# EAGLE design tiny (EAGLE 6.1)

## Sheet 1 of 2
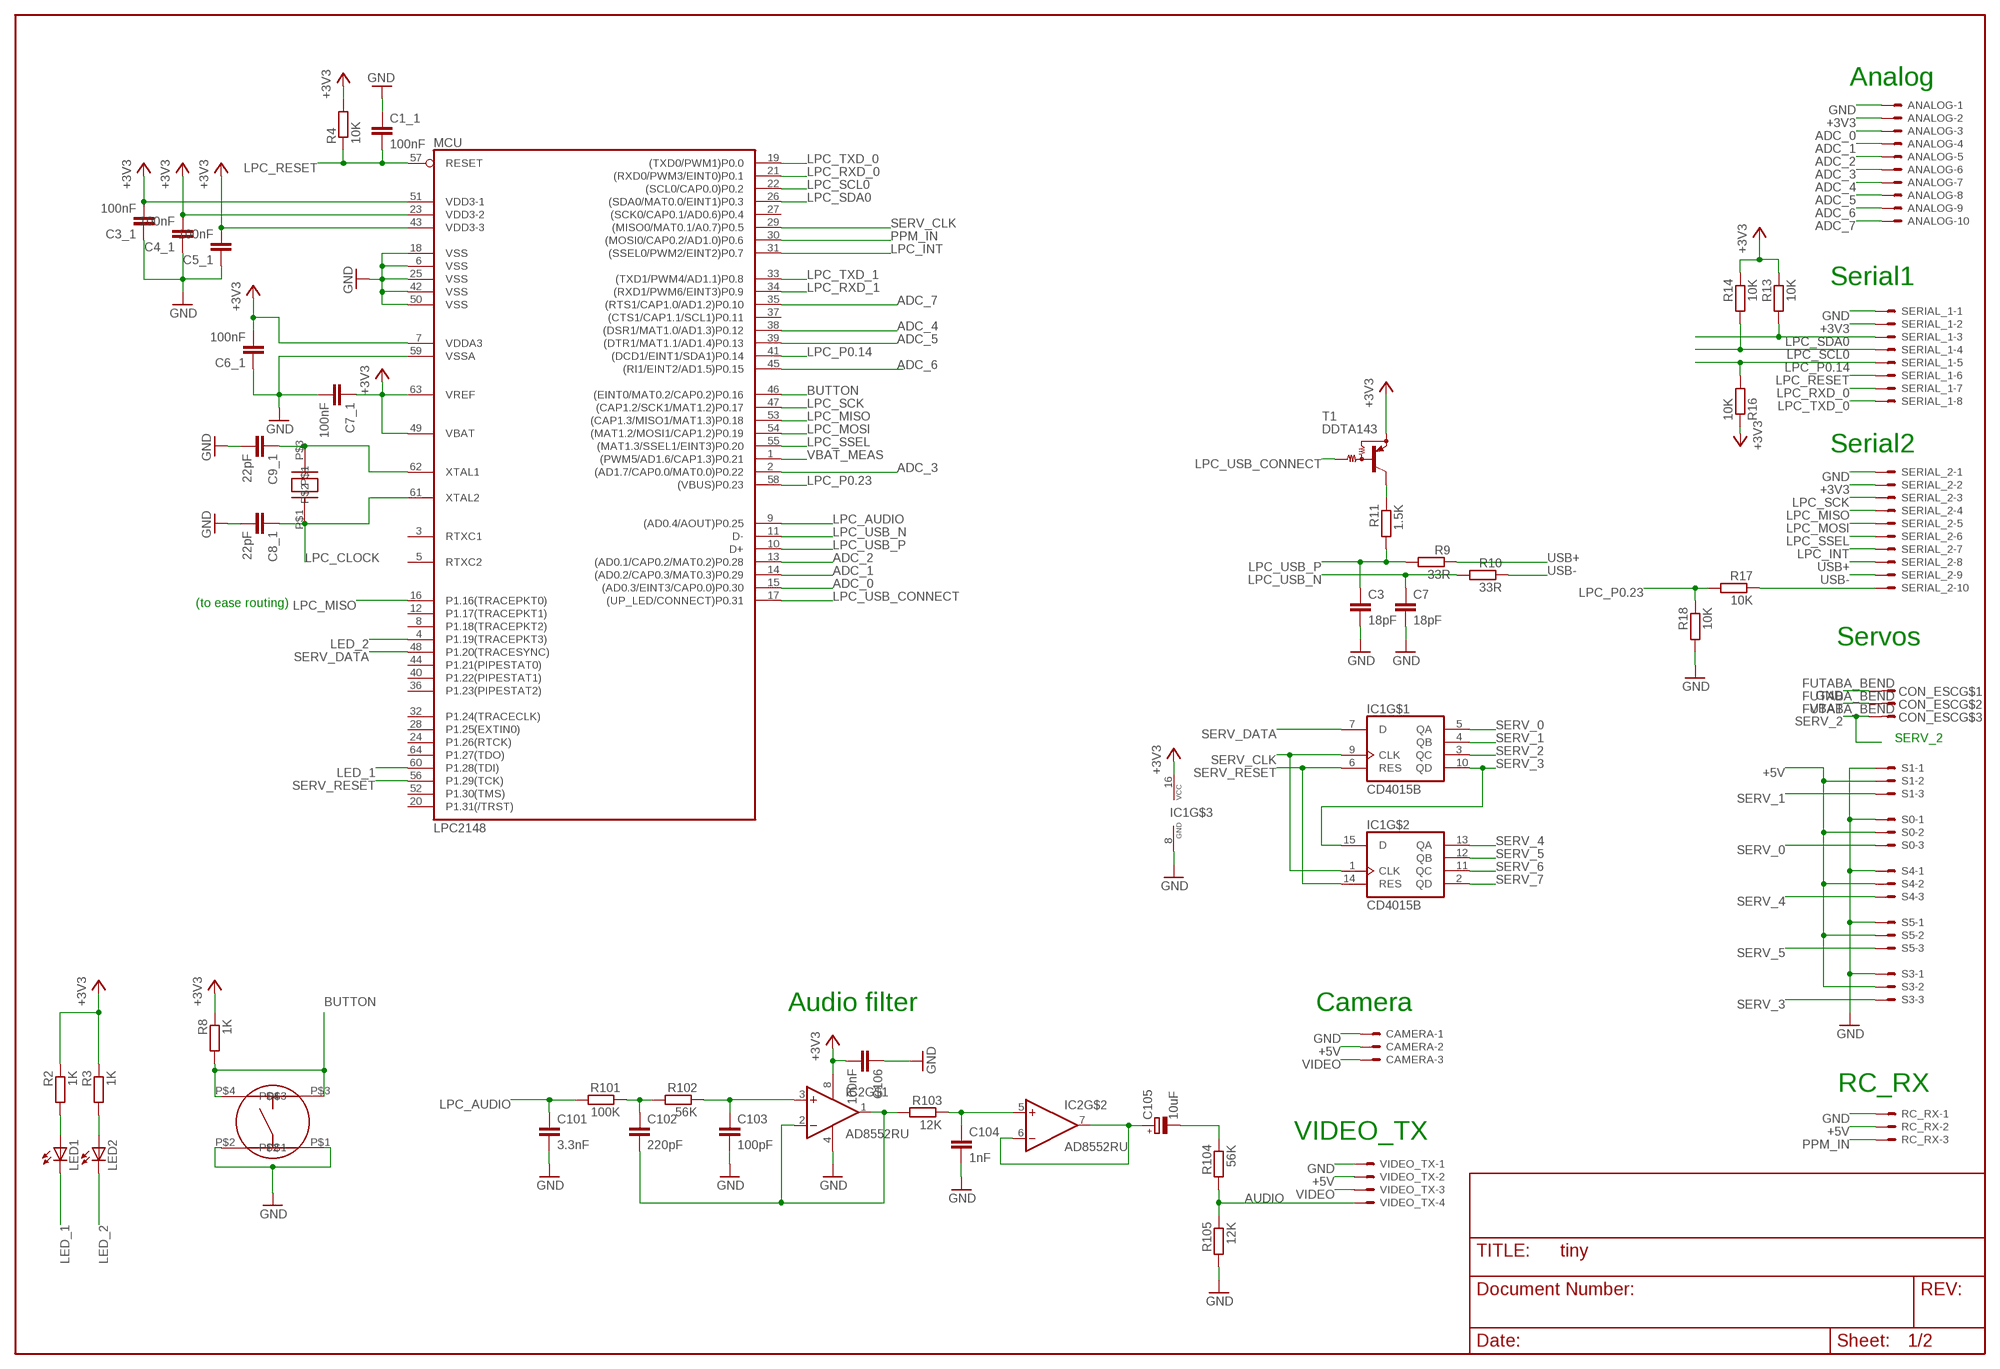
[diagram p0: schematic, sheet 1]

### Parts
ANALOG  53047-10  [53047-10]
C1_1  100nF  C-EUC0402K  [C0402K]
C3  18pF  C-EUC0402K  [C0402K]
C3_1  100nF  C-EUC0402K  [C0402K]
C4_1  100nF  C-EUC0402K  [C0402K]
C5_1  100nF  C-EUC0402K  [C0402K]
C6_1  100nF  C-EUC0402K  [C0402K]
C7  18pF  C-EUC0402K  [C0402K]
C7_1  100nF  C-EUC0402K  [C0402K]
C8_1  22pF  C-EUC0402K  [C0402K]
C9_1  22pF  C-EUC0402K  [C0402K]
C101  3.3nF  C-EUC0402K  [C0402K]
C102  220pF  C-EUC0402K  [C0402K]
C103  100pF  C-EUC0402K  [C0402K]
C104  1nF  C-EUC0402K  [C0402K]
C105  10uF  CPOL-EUA/3216-18R  [A/3216-18R]
C106  100nF  C-EUC0402K  [C0402K]
CAMERA  53047-03  [53047-03]
CON_ESC  FUTABA_BEND  [FUTABA_BENDED]
IC1  CD4015B  [TSSOP16]
IC2  AD8552RU  [TSSOP8]
LED1  LEDCHIP-LED0805  [CHIP-LED0805]
LED2  LEDCHIP-LED0805  [CHIP-LED0805]
MCU  LPC2148  [SQFP-S-10X10-64]
Q1  12MHz  CRYSTAL_CTS  [CTS_CRYSTAL]
R2  1K  R-EU_R1005  [R1005]
R3  1K  R-EU_R1005  [R1005]
R4  10K  R-EU_R1005  [R1005]
R8  1K  R-EU_R1005  [R1005]
R9  33R  R-EU_R1005  [R1005]
R10  33R  R-EU_R1005  [R1005]
R11  1.5K  R-EU_R1005  [R1005]
R13  10K  R-EU_R1005  [R1005]
R14  10K  R-EU_R1005  [R1005]
R16  10K  R-EU_R1005  [R1005]
R17  10K  R-EU_R1005  [R1005]
R18  10K  R-EU_R1005  [R1005]
R101  100K  R-EU_R1005  [R1005]
R102  56K  R-EU_R1005  [R1005]
R103  12K  R-EU_R1005  [R1005]
R104  56K  R-EU_R1005  [R1005]
R105  12K  R-EU_R1005  [R1005]
RC_RX  53047-03  [53047-03]
S0  53047-03  [53047-03]
S1  53047-03  [53047-03]
S3  53047-03  [53047-03]
S4  53047-03  [53047-03]
S5  53047-03  [53047-03]
SERIAL_1  53047-08  [53047-08]
SERIAL_2  53047-10  [53047-10]
SW1  B3S  [B3S]
T1  DDTA143  MUN2111T1  [SC59-BEC]
VIDEO_TX  53047-04  [53047-04]

### Nets
+3V3: ANALOG.2 C3_1.2 C4_1.2 C5_1.2 C6_1.2 C7_1.1 C106.2 IC1.16(VCC) IC2.8(V+) MCU.7(VDDA3) MCU.23(VDD3-2) MCU.43(VDD3-3) MCU.49(VBAT) MCU.51(VDD3-1) MCU.63(VREF) R2.1 R3.1 R4.2 R8.1 R13.1 R14.1 R16.1 SERIAL_1.2 SERIAL_2.2 T1.E ; also sheet 2
+5V: CAMERA.2 RC_RX.2 S0.2 S1.2 S3.2 S4.2 S5.2 VIDEO_TX.2 ; also sheet 2
ADC_0: ANALOG.3 MCU.15((AD0.3/EINT3/CAP0.0)P0.30)
ADC_1: ANALOG.4 MCU.14((AD0.2/CAP0.3/MAT0.3)P0.29)
ADC_2: ANALOG.5 MCU.13((AD0.1/CAP0.2/MAT0.2)P0.28)
ADC_3: ANALOG.6 MCU.2((AD1.7/CAP0.0/MAT0.0)P0.22)
ADC_4: ANALOG.7 MCU.38((DSR1/MAT1.0/AD1.3)P0.12)
ADC_5: ANALOG.8 MCU.39((DTR1/MAT1.1/AD1.4)P0.13)
ADC_6: ANALOG.9 MCU.45((RI1/EINT2/AD1.5)P0.15)
ADC_7: ANALOG.10 MCU.35((RTS1/CAP1.0/AD1.2)P0.10)
AUDIO: R104.2 R105.1 VIDEO_TX.4
BUTTON: MCU.46((EINT0/MAT0.2/CAP0.2)P0.16) R8.2 SW1.P$3 SW1.P$4
GND: ANALOG.1 C1_1.1 C3.2 C3_1.1 C4_1.1 C5_1.1 C6_1.1 C7.2 C7_1.2 C8_1.2 C9_1.2 C101.2 C103.2 C104.2 C106.1 CAMERA.1 CON_ESC.1 IC1.8(GND) IC2.4(V-) MCU.6(VSS) MCU.18(VSS) MCU.25(VSS) MCU.42(VSS) MCU.50(VSS) MCU.59(VSSA) R18.2 R105.2 RC_RX.1 S0.1 S1.1 S3.1 S4.1 S5.1 SERIAL_1.1 SERIAL_2.1 SW1.P$1 SW1.P$2 VIDEO_TX.1 ; also sheet 2
LED_1: LED1.C MCU.60(P1.28(TDI))
LED_2: LED2.C MCU.4(P1.19(TRACEPKT3))
LPC_AUDIO: C101.1 MCU.9((AD0.4/AOUT)P0.25) R101.2
LPC_CLOCK: C8_1.1 MCU.61(XTAL2) Q1.P$1
LPC_INT: MCU.31((SSEL0/PWM2/EINT2)P0.7) SERIAL_2.7
LPC_MISO: MCU.16(P1.16(TRACEPKT0)) MCU.53((CAP1.3/MISO1/MAT1.3)P0.18) SERIAL_2.4
LPC_MOSI: MCU.54((MAT1.2/MOSI1/CAP1.2)P0.19) SERIAL_2.5
LPC_P0.14: MCU.41((DCD1/EINT1/SDA1)P0.14) R16.2 SERIAL_1.5
LPC_P0.23: MCU.58((VBUS)P0.23) R17.2 R18.1
LPC_RESET: C1_1.2 MCU.57(RESET) R4.1 SERIAL_1.6
LPC_RXD_0: MCU.21((RXD0/PWM3/EINT0)P0.1) SERIAL_1.7
LPC_RXD_1: MCU.34((RXD1/PWM6/EINT3)P0.9) ; also sheet 2
LPC_SCK: MCU.47((CAP1.2/SCK1/MAT1.2)P0.17) SERIAL_2.3
LPC_SCL0: MCU.22((SCL0/CAP0.0)P0.2) R14.2 SERIAL_1.4
LPC_SDA0: MCU.26((SDA0/MAT0.0/EINT1)P0.3) R13.2 SERIAL_1.3
LPC_SSEL: MCU.55((MAT1.3/SSEL1/EINT3)P0.20) SERIAL_2.6
LPC_TXD_0: MCU.19((TXD0/PWM1)P0.0) SERIAL_1.8
LPC_TXD_1: MCU.33((TXD1/PWM4/AD1.1)P0.8) ; also sheet 2
LPC_USB_CONNECT: MCU.17((UP_LED/CONNECT)P0.31) T1.B
LPC_USB_N: C7.1 MCU.11(D-) R10.2
LPC_USB_P: C3.1 MCU.10(D+) R9.2 R11.2
N$4: R17.1 SERIAL_2.10
N$5: C9_1.1 MCU.62(XTAL1) Q1.P$3
N$7: R11.1 T1.C
N$14: C105.+ IC2.6(-IN) IC2.7(OUT)
N$15: C102.2 IC2.1(OUT) IC2.2(-IN) R103.2
N$16: C102.1 R101.1 R102.2
N$17: C103.1 IC2.3(+IN) R102.1
N$18: C105.- R104.1
N$19: C104.1 IC2.5(+IN) R103.1
N$21: LED1.A R2.2
N$22: LED2.A R3.2
PPM_IN: MCU.30((MOSI0/CAP0.2/AD1.0)P0.6) RC_RX.3
SERV_0: IC1.5(QA) S0.3
SERV_1: IC1.4(QB) S1.3
SERV_2: CON_ESC.3 IC1.3(QC)
SERV_3: IC1.10(QD) IC1.15(D) S3.3
SERV_4: IC1.13(QA) S4.3
SERV_5: IC1.12(QB) S5.3
SERV_6: IC1.11(QC)
SERV_7: IC1.2(QD)
SERV_CLK: IC1.1(CLK) IC1.9(CLK) MCU.29((MISO0/MAT0.1/A0.7)P0.5)
SERV_DATA: IC1.7(D) MCU.48(P1.20(TRACESYNC))
SERV_RESET: IC1.6(RES) IC1.14(RES) MCU.56(P1.29(TCK))
USB+: R9.1 SERIAL_2.8
USB-: R10.1 SERIAL_2.9
VBAT: CON_ESC.2 ; also sheet 2
VBAT_MEAS: MCU.1((PWM5/AD1.6/CAP1.3)P0.21) ; also sheet 2
VIDEO: CAMERA.3 VIDEO_TX.3
Unconnected: MCU.3(RTXC1) MCU.5(RTXC2) MCU.8(P1.18(TRACEPKT2)) MCU.12(P1.17(TRACEPKT1)) MCU.20(P1.31(/TRST)) MCU.24(P1.26(RTCK)) MCU.27((SCK0/CAP0.1/AD0.6)P0.4) MCU.28(P1.25(EXTIN0)) MCU.32(P1.24(TRACECLK)) MCU.36(P1.23(PIPESTAT2)) MCU.37((CTS1/CAP1.1/SCL1)P0.11) MCU.40(P1.22(PIPESTAT1)) MCU.44(P1.21(PIPESTAT0)) MCU.52(P1.30(TMS)) MCU.64(P1.27(TDO))

### Notes on the sheet
- Analog
- Serial1
- Serial2
- (to ease routing)
- Servos
- SERV_2
- Audio filter | Camera
- RC_RX
- VIDEO_TX

## Sheet 2 of 2
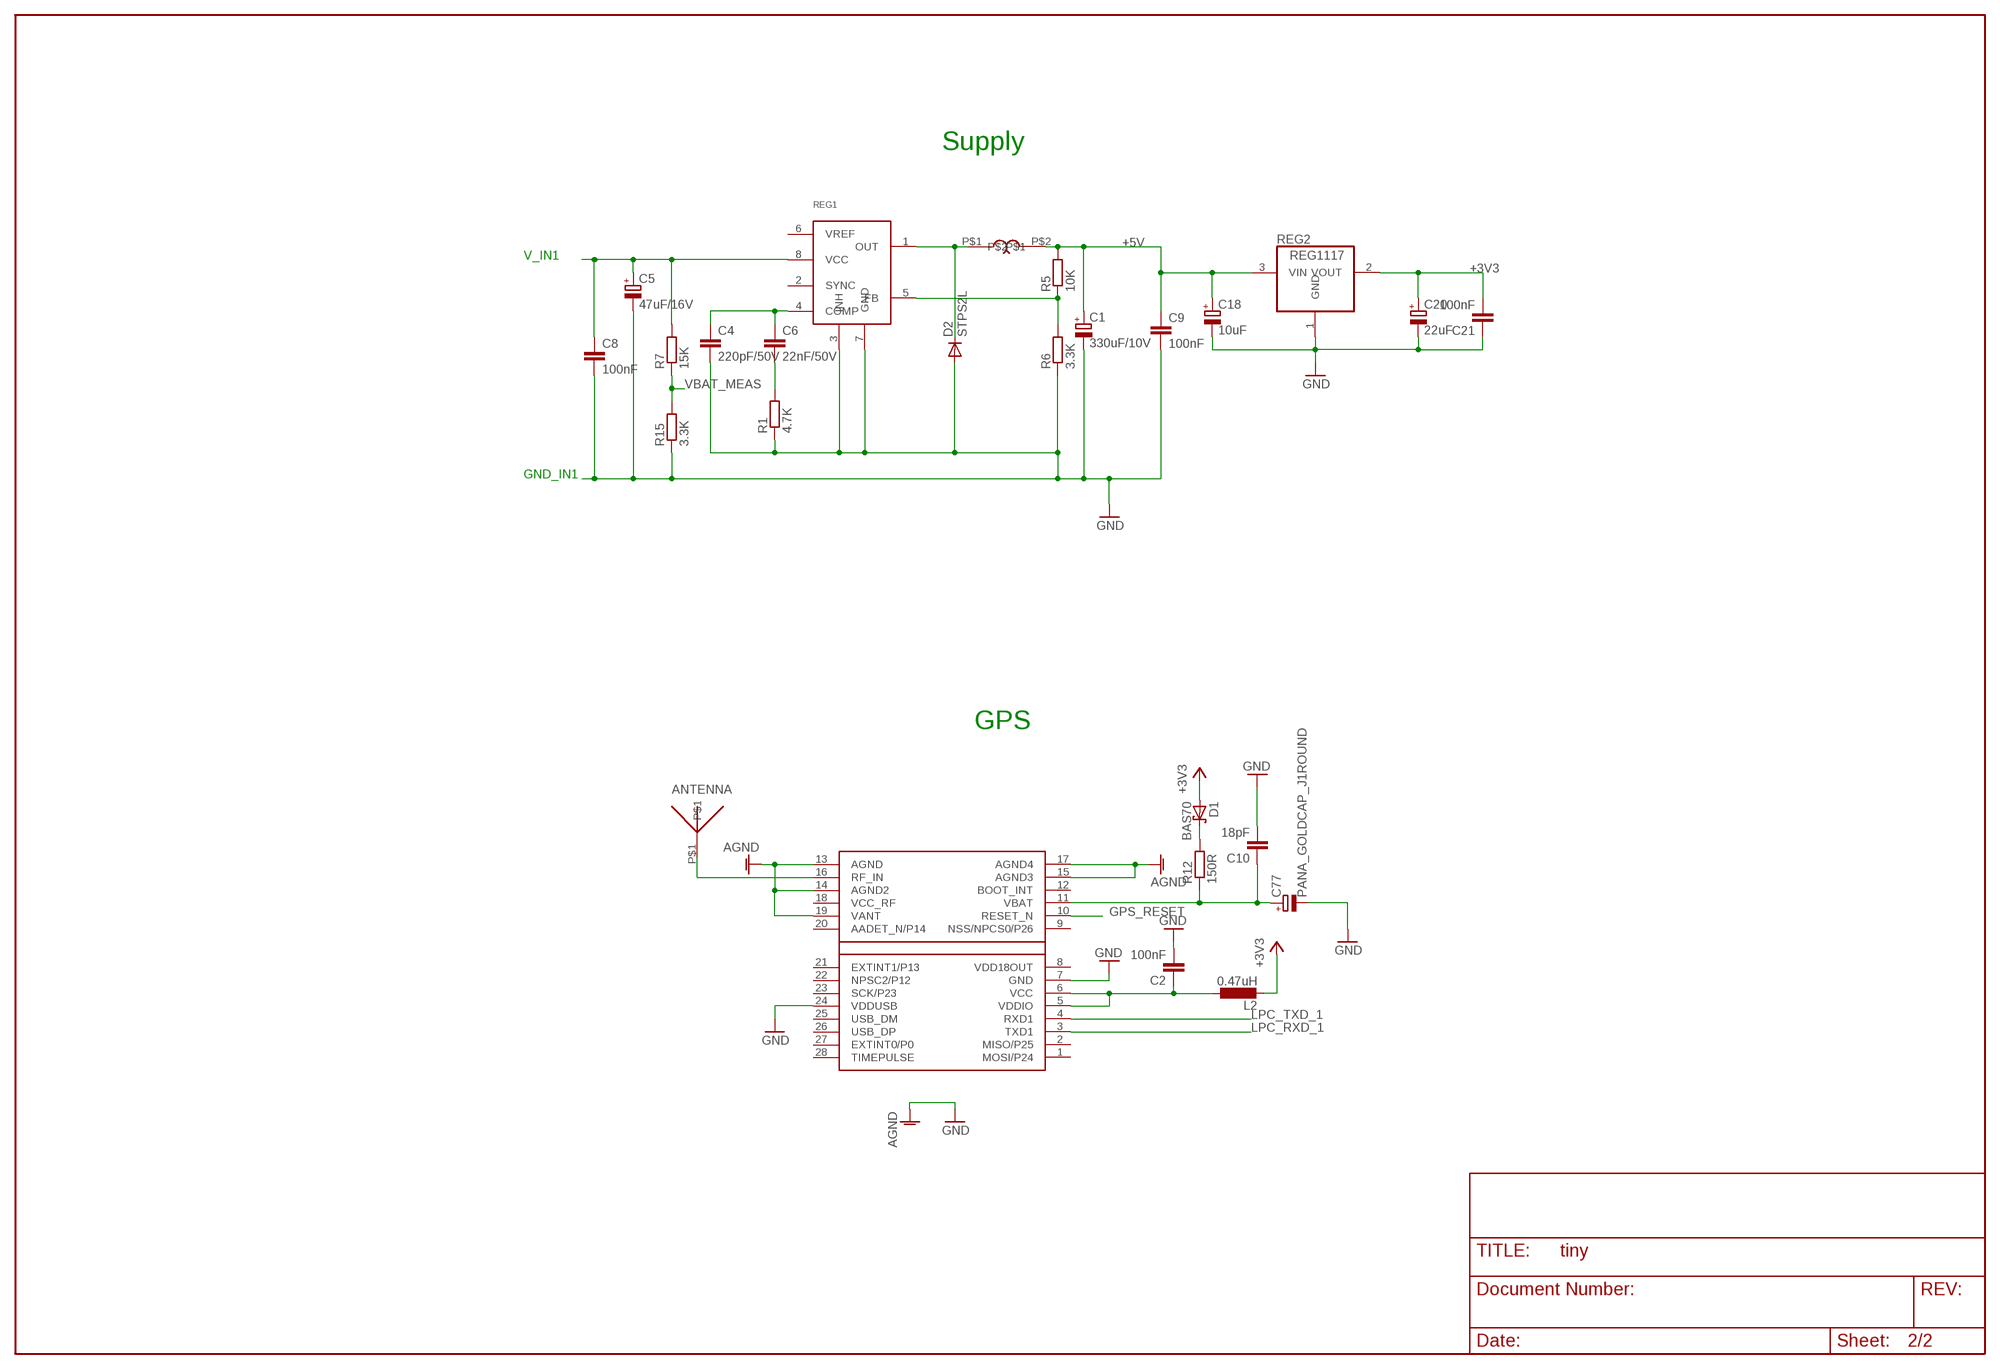
[diagram p1: schematic, sheet 2]

### Parts
ANTENNA  GPS_ANT_13  [GPS_ANT_13]
C1  330uF/10V  CPOL-EUD/7343-31R  [D/7343-31R]
C2  100nF  C-EUC0402K  [C0402K]
C4  220pF/50V  C-EUC1206K  [C1206K]
C5  47uF/16V  CPOL-EUD/7343-31R  [D/7343-31R]
C6  22nF/50V  C-EUC1206K  [C1206K]
C8  100nF  C-EUC0603  [C0603]
C9  100nF  C-EUC0603  [C0603]
C10  18pF  C-EUC0402K  [C0402K]
C18  10uF  CPOL-EUA/3216-18R  [A/3216-18R]
C20  22uF  CPOL-EUB/3528-21R  [B/3528-21R]
C21  100nF  C-EUC0603  [C0603]
C77  PANA_GOLDCAP_J1ROUND  [PANA_J1_BIS]
D1  BAS70  [SOT23]
D2  STPS2L  [SMA]
GPS  LEA-4P  [LEA-LA]
L1  15uH  WE_PD  [WE_PD]
L2  0.47uH  L-EUL2012C  [L2012C]
R1  4.7K  R-EU_R1005  [R1005]
R5  10K  R-EU_R1005  [R1005]
R6  3.3K  R-EU_R1005  [R1005]
R7  15K  R-EU_R1005  [R1005]
R12  150R  R-EU_R1005  [R1005]
R15  3.3K  R-EU_R1005  [R1005]
REG1  L5973D  [SO08]
REG2  REG1117  [SOT223]

### Nets
+3V3: C20.+ C21.2 D1.1(A) L2.2 REG2.2(VOUT) ; also sheet 1
+5V: C1.+ C9.1 C18.+ L1.P$2 R5.2 REG2.3(VIN) ; also sheet 1
GND: C1.- C2.2 C4.2 C5.- C8.2 C9.2 C10.2 C18.- C20.- C21.1 C77.MINUS(-) D2.P$1(A) GPS.7(GND) GPS.13(AGND) GPS.14(AGND2) GPS.15(AGND3) GPS.17(AGND4) GPS.19(VANT) GPS.24(VDDUSB) R1.1 R6.1 R15.1 REG1.3(INH) REG1.7(GND) REG2.1(GND) ; supply symbol labelled AGND ; also sheet 1
GPS_RESET: GPS.10(RESET_N)
LPC_RXD_1: GPS.3(TXD1) ; also sheet 1
LPC_TXD_1: GPS.4(RXD1) ; also sheet 1
N$1: C2.1 GPS.5(VDDIO) GPS.6(VCC) L2.1
N$3: ANTENNA.P$1 GPS.16(RF_IN)
N$6: C4.1 C6.1 REG1.4(COMP)
N$8: C6.2 R1.2
N$9: D2.P$2(C) L1.P$1 REG1.1(OUT)
N$10: R5.1 R6.2 REG1.5(FB)
N$28: C10.1 C77.PLUS(+) GPS.11(VBAT) R12.1
N$29: D1.3(C) R12.2
VBAT: C5.+ C8.1 R7.2 REG1.8(VCC) ; also sheet 1
VBAT_MEAS: R7.1 R15.2 ; also sheet 1
Unconnected: GPS.1(MOSI/P24) GPS.2(MISO/P25) GPS.9(NSS/NPCS0/P26) GPS.12(BOOT_INT) GPS.20(AADET_N/P14) GPS.21(EXTINT1/P13) GPS.22(NPSC2/P12) GPS.23(SCK/P23) GPS.25(USB_DM) GPS.26(USB_DP) GPS.27(EXTINT0/P0) GPS.28(TIMEPULSE) REG1.2(SYNC) REG1.6(VREF)

### Notes on the sheet
- Supply
- V_IN1
- GND_IN1
- GPS

## Power pins joined to a net without a drawn wire
VCC_RF: GPS.18(VCC_RF)
VDD18OUT: GPS.8(VDD18OUT)

## Library data of the parts
ANALOG SERIAL_2 = con-molex:53?-10: CONNECTOR wire to board 1.25 mm (.049 inch) pitch header
ANTENNA = paparazzi:GPS_ANT_13: Sangshin KSA-ST1575MS13
C1 C5 C18 C20 C105 = rcl:CPOL-EU: POLARIZED CAPACITOR, European symbol
C1_1 C2 C3 C3_1 C4 C4_1 C5_1 C6 C6_1 C7 C7_1 C8 C8_1 C9 C9_1 C10 C21 C101-C104 C106 = rcl:C-EU: CAPACITOR, European symbol
C77 = paparazzi:PANA_GOLDCAP_J1
CAMERA RC_RX S0 S1 S3-S5 = con-molex:53?-03: CONNECTOR wire to board 1.25 mm (.049 inch) pitch header
CON_ESC = paparazzi:FUTABA_BEND
D1 = diode:BAS70: Silicon Schottky Diodes General-purpose diode for high-speed switching
D2 = paparazzi:STPS2L
GPS = paparazzi:LEA-4P
IC1 = paparazzi:CD4015B
IC2 = paparazzi:AD8552: dual op amp
L1 = paparazzi:WE_PD
L2 = rcl:L-EU: INDUCTOR, European symbol
LED1 LED2 = led:LED: LED OSRAM: - CHIPLED LG R971, LG N971, LY N971, LG Q971, LY Q971, LO R971, LY R971 LH N974, LH R974 LS Q976, LO Q976, LY Q976 LO Q996 - Hyper CHIPLED LW Q18S LB Q993, LB Q99A, LB R99A - SideLED LS A670, LO A670, LY A670, LG A670, LP A670 LB A673, LV A673, LT A673, LW A673 LH A674 LY A675 LS A676, LA A676, LO A676, LY A676, LW A676 LS A679, LY A679, LG A679 - Hyper Micro SIDELED® LS Y876, LA Y876, LO Y876, LY Y876 LT Y87S - SmartLED LW L88C, LW L88S LB L89C, LB L89S, LG L890 LS L89K, LO L89K, LY L89K LS L896, LA L896, LO L896, LY L896 - TOPLED LS T670, LO T670, LY T670, LG T670, LP T670 LSG T670, LSP T670, LSY T670, LOP T670, LYG T670 LG T671, LOG T671, LSG T671 LB T673, LV T673, LT T673, LW T673 LH T674 LS T676, LA T676, LO T676, LY T676, LB T676, LH T676, LSB T676, LW T676 LB T67C, LV T67C, LT T67C, LS T67K, LO T67K, LY T67K, LW E67C LS E67B, LA E67B, LO E67B, LY E67B, LB E67C, LV E67C, LT E67C LW T67C LS T679, LY T679, LG T679 LS T770, LO T770, LY T770, LG T770, LP T770 LB T773, LV T773, LT T773, LW T773 LH T774 LS E675, LA E675, LY E675, LS T675 LS T776, LA T776, LO T776, LY T776, LB T776 LHGB T686 LT T68C, LB T68C - Hyper Mini TOPLED® LB M676 - Mini TOPLED Santana® LG M470 LS M47K, LO M47K, LY M47K Source: http://www.osram.convergy.de/
MCU = paparazzi:LPC2148
Q1 = paparazzi:CRYSTAL_CTS
R1-R18 R101-R105 = rcl:R-EU_: RESISTOR, European symbol
REG1 = paparazzi:L5973D
REG2 = burr-brown:REG1117: 800mA and 1A Low Dropout (LDO) Positive Regulator 1.8V, 2.5V, 2.85V, 3.3V, 5V, and Adj
SERIAL_1 = con-molex:53?-08: CONNECTOR wire to board 1.25 mm (.049 inch) pitch header
SW1 = paparazzi:B3S
T1 = transistor-pnp:MUN2111*: PNP Bias Resistor Transistor
VIDEO_TX = con-molex:53?-04: CONNECTOR wire to board 1.25 mm (.049 inch) pitch header

## Board
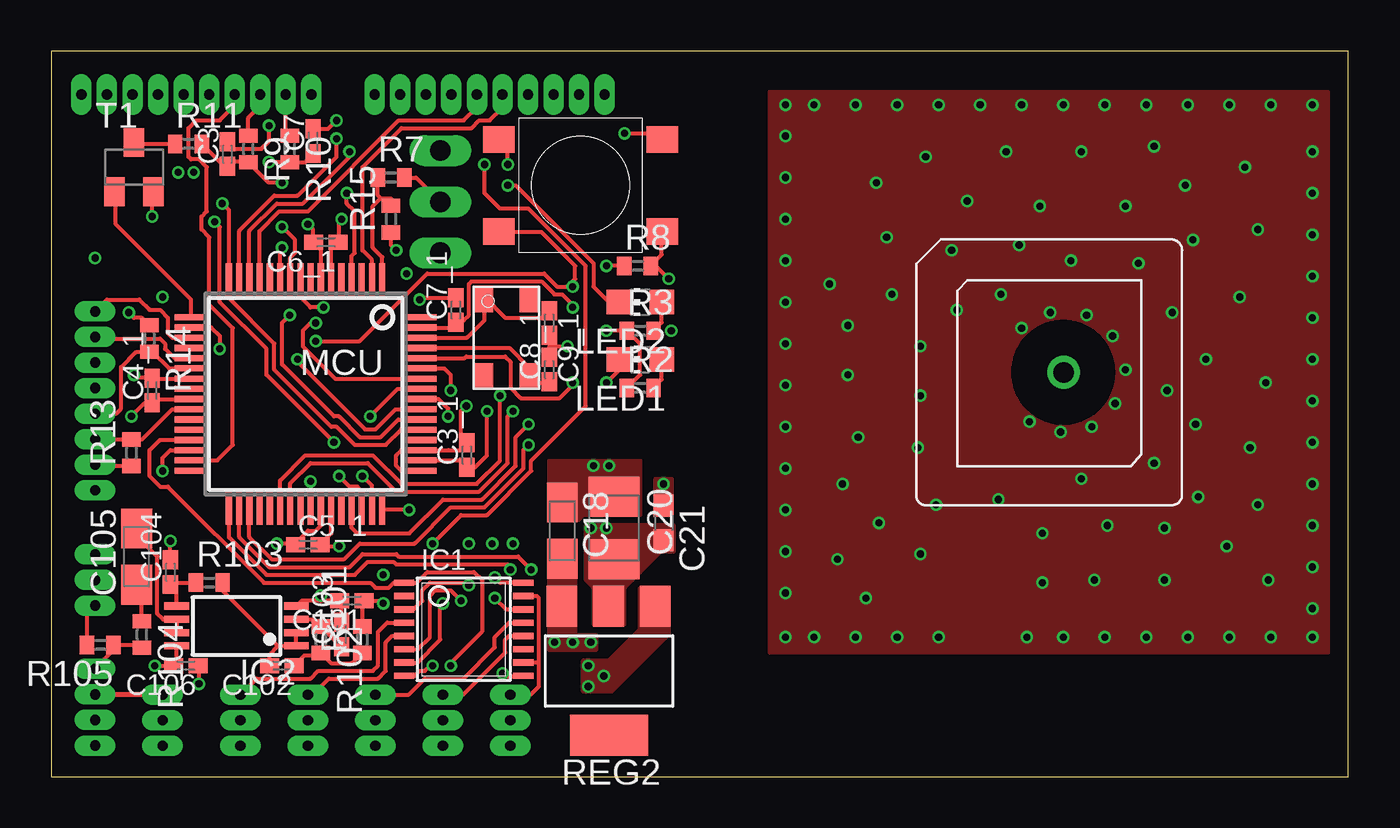
[diagram p2: board, top side]
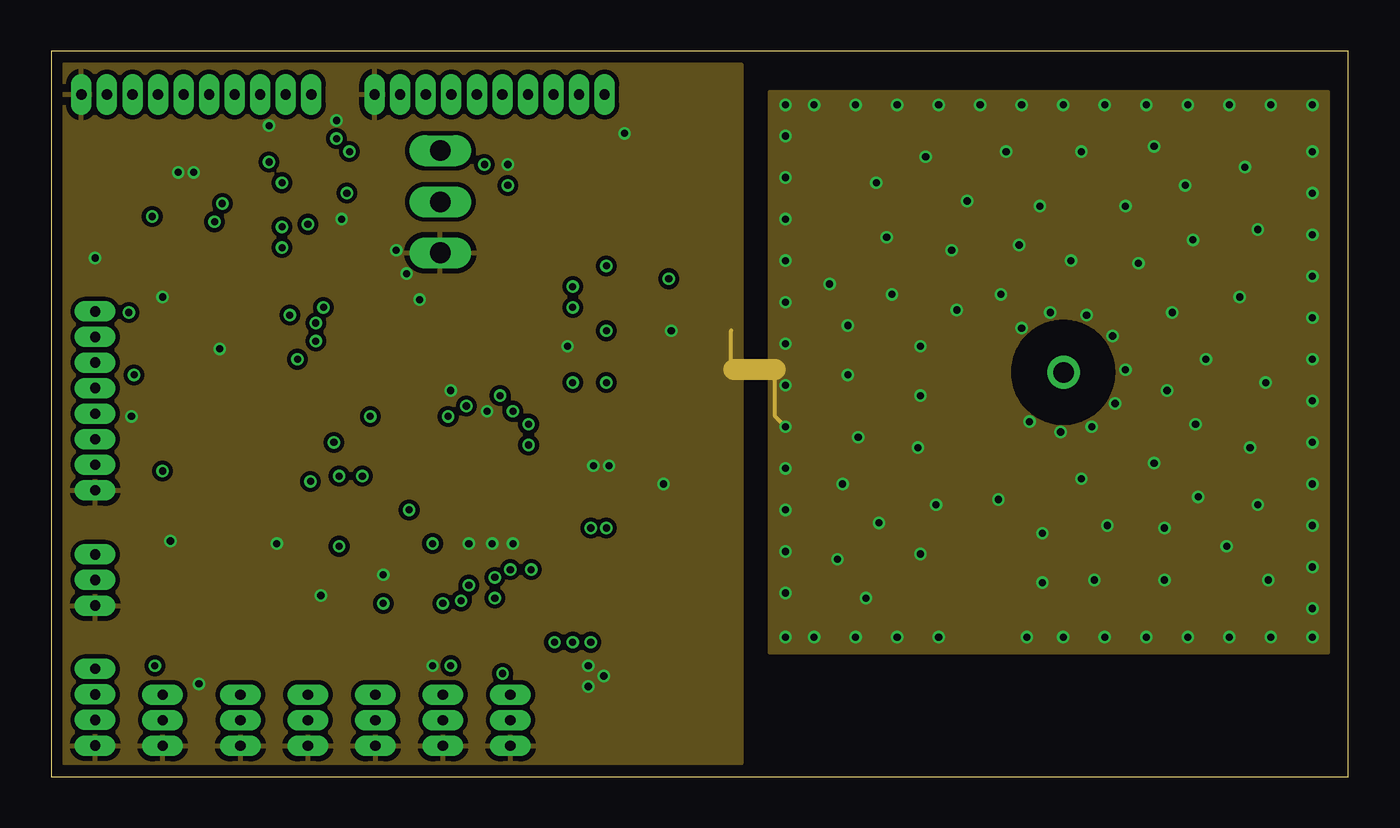
[diagram p3: board, inner layer Route2]
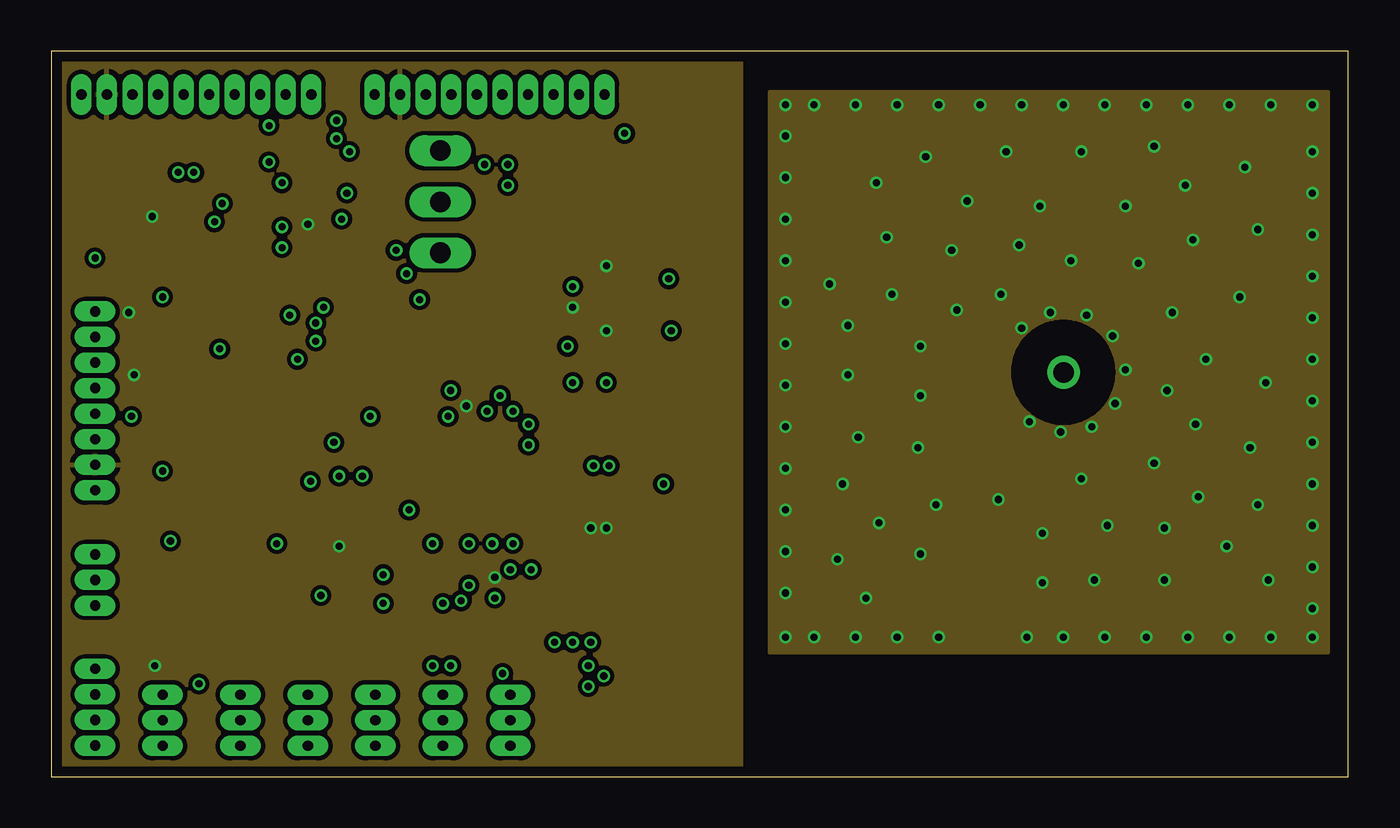
[diagram p4: board, inner layer Route15]
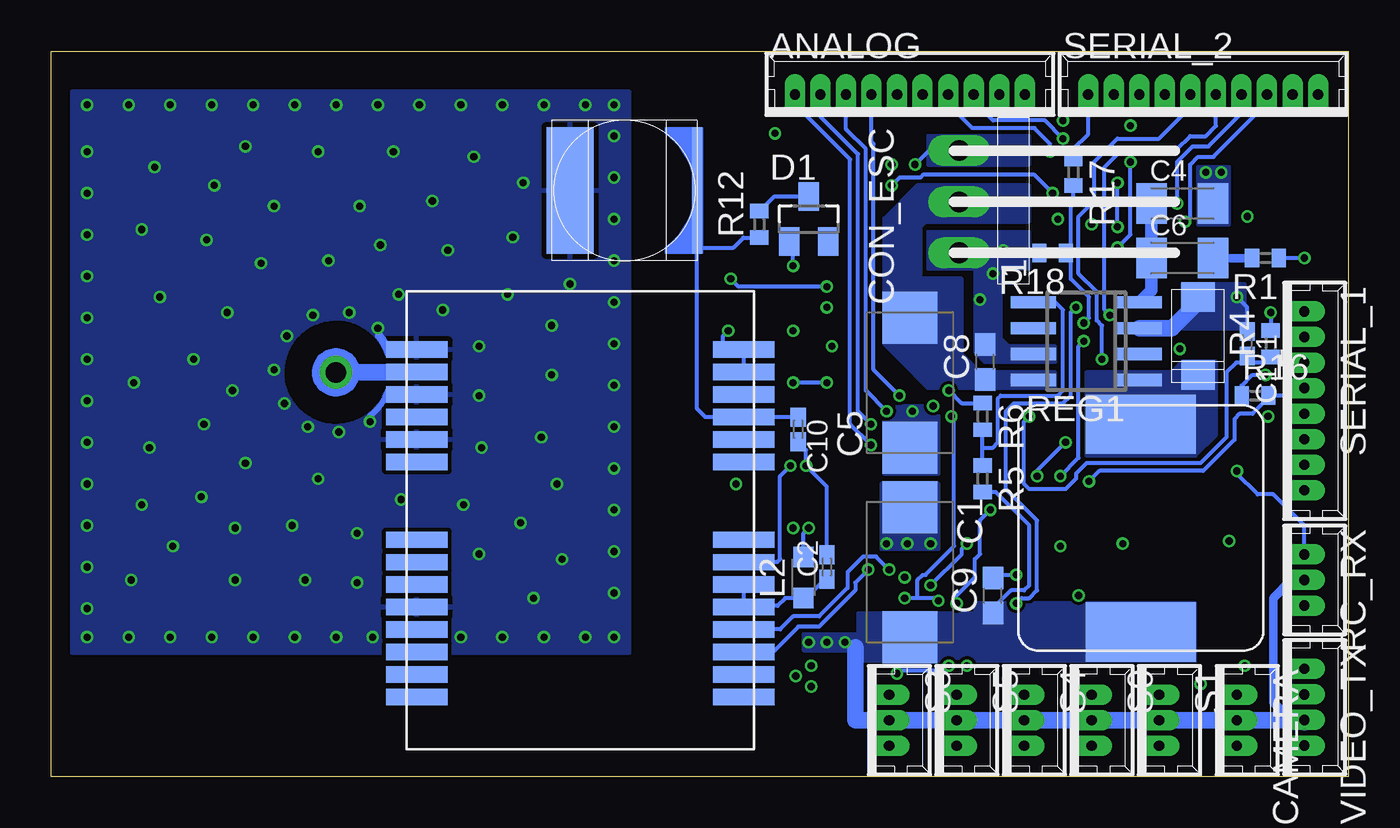
[diagram p5: board, bottom side, seen from below]

Size 63.48 x 35.48 mm. Coordinates in mm from the lower left corner, seen from the top.
Outline: 0,0 63.48,0 63.48,35.48 0,35.48 0,0
Copper layers ((1*2)+(15*16)): Top 0.035mm / dielectric 0.2mm / Route2 0.035mm / dielectric 1.5mm / Route15 0.035mm / dielectric 0.2mm / Bottom 0.035mm
Design rules: minimum track width 0.15mm, minimum drill 0.35mm, track to track 0.15mm, track to pad 0.15mm, pad to pad 0.15mm, via to via 0.15mm, smd to smd 0.15mm, copper to edge 20mil, drill to drill 8mil, minimum pad ring 10mil, minimum via ring 5mil, stop-mask expansion 4mil, vias tented up to drill 0mil, thermal gap 10mil
tRestrict: area 47.5,17.8 to 51.6,21.8; area 48.2,18.4 to 50.9,21.2
bRestrict: 4 lines

### Footprints (pad centres in the part's own frame; a part is rotated, then mirrored left to right if it is on the bottom)
53047-10 = drill 0.5 pad 0.698 long: 1 5.625,0; 2 4.375,0; 3 3.125,0; 4 1.875,0; 5 0.625,0; 6 -0.625,0; 7 -1.875,0; 8 -3.125,0; 9 -4.375,0; 10 -5.625,0
GPS_ANT_13 = drill 1 pad 1.6: P$1 0,-0.7
D/7343-31R = smd 2.55 x 2.7: + 3.175,0; - -3.175,0
C0402K = smd 0.925 x 0.74: 1 -0.6,0; 2 0.6,0
C1206K = smd 1.5 x 2: 1 -1.5,0; 2 1.5,0
C0603 = smd 1.1 x 1: 1 -0.85,0; 2 0.85,0
A/3216-18R = smd 1.95 x 1.5: + 1.375,0; - -1.375,0
B/3528-21R = smd 1.95 x 2.5: + 1.525,0; - -1.525,0
PANA_J1_BIS = smd 6.2 x 2.3: MINUS 0,-2.794 | smd 6.198 x 0.508: PLUS 0,3.429
53047-03 = drill 0.5 pad 0.698 long: 1 1.25,0; 2 0,0; 3 -1.25,0
FUTABA_BENDED = drill 1.016 long: 1 -2.54,5.715; 2 -0.051,5.715; 3 2.464,5.715
SOT23 = smd 1 x 1.4: 1 -0.95,-1.1; 2 0.95,-1.1; 3 0,1.1
SMA = smd 1.45 x 1.65: P$1 -1.905,0; P$2 1.905,0
LEA-LA = smd 3 x 0.8: 1 8,-8.65; 2 8,-7.55; 3 8,-6.45; 4 8,-5.35; 5 8,-4.25; 6 8,-3.15; 7 8,-2.05; 8 8,-0.95; 9 8,2.85; 10 8,3.95; 11 8,5.05; 12 8,6.15; 13 8,7.25; 14 8,8.35; 15 -8,8.35; 16 -8,7.25; 17 -8,6.15; 18 -8,5.05; 19 -8,3.95; 20 -8,2.85; 21 -8,-0.95; 22 -8,-2.05; 23 -8,-3.15; 24 -8,-4.25; 25 -8,-5.35; 26 -8,-6.45; 27 -8,-7.55; 28 -8,-8.65
TSSOP16 = smd 0.305 x 0.991: 1 -2.275,-2.918; 2 -1.625,-2.918; 3 -0.975,-2.918; 4 -0.325,-2.918; 5 0.325,-2.918; 6 0.975,-2.918; 7 1.625,-2.918; 8 2.275,-2.918; 9 2.275,2.918; 10 1.625,2.918; 11 0.975,2.918; 12 0.325,2.918; 13 -0.325,2.918; 14 -0.975,2.918; 15 -1.625,2.918; 16 -2.275,2.918
TSSOP8 = smd 0.35 x 1.2: 1 -0.975,-2.925; 2 -0.325,-2.925; 3 0.325,-2.925; 4 0.975,-2.925; 5 0.975,2.925; 6 0.325,2.925; 7 -0.325,2.925; 8 -0.975,2.925
WE_PD = smd 2.9 x 5.4: P$1 -5.08,0; P$2 5.08,0
L2012C = smd 1 x 1: 1 -1,0; 2 1,0
CHIP-LED0805 = smd 1.2 x 1.2: A 0,-1.05; C 0,1.05
SQFP-S-10X10-64 = smd 0.3 x 1.6: 1 -3.75,-5.6; 2 -3.25,-5.6; 3 -2.75,-5.6; 4 -2.25,-5.6; 5 -1.75,-5.6; 6 -1.25,-5.6; 7 -0.75,-5.6; 8 -0.25,-5.6; 9 0.25,-5.6; 10 0.75,-5.6; 11 1.25,-5.6; 12 1.75,-5.6; 13 2.25,-5.6; 14 2.75,-5.6; 15 3.25,-5.6; 16 3.75,-5.6; 33 3.75,5.6; 34 3.25,5.6; 35 2.75,5.6; 36 2.25,5.6; 37 1.75,5.6; 38 1.25,5.6; 39 0.75,5.6; 40 0.25,5.6; 41 -0.25,5.6; 42 -0.75,5.6; 43 -1.25,5.6; 44 -1.75,5.6; 45 -2.25,5.6; 46 -2.75,5.6; 47 -3.25,5.6; 48 -3.75,5.6 | smd 1.6 x 0.3: 17 5.6,-3.75; 18 5.6,-3.25; 19 5.6,-2.75; 20 5.6,-2.25; 21 5.6,-1.75; 22 5.6,-1.25; 23 5.6,-0.75; 24 5.6,-0.25; 25 5.6,0.25; 26 5.6,0.75; 27 5.6,1.25; 28 5.6,1.75; 29 5.6,2.25; 30 5.6,2.75; 31 5.6,3.25; 32 5.6,3.75; 49 -5.6,3.75; 50 -5.6,3.25; 51 -5.6,2.75; 52 -5.6,2.25; 53 -5.6,1.75; 54 -5.6,1.25; 55 -5.6,0.75; 56 -5.6,0.25; 57 -5.6,-0.25; 58 -5.6,-0.75; 59 -5.6,-1.25; 60 -5.6,-1.75; 61 -5.6,-2.25; 62 -5.6,-2.75; 63 -5.6,-3.25; 64 -5.6,-3.75
CTS_CRYSTAL = smd 1.2 x 0.9: P$1 -1.85,-1.1; P$2 1.85,-1.1; P$3 1.85,1.1; P$4 -1.85,1.1
R1005 = smd 0.7 x 0.9: 1 -0.65,0; 2 0.65,0
SO08 = smd 0.6 x 2.2: 1 -1.905,-2.6; 2 -0.635,-2.6; 3 0.635,-2.6; 4 1.905,-2.6; 5 1.905,2.6; 6 0.635,2.6; 7 -0.635,2.6; 8 -1.905,2.6
SOT223 = smd 1.499 x 2.007: 1 -2.261,-3.15; 2 0.025,-3.15; 3 2.311,-3.15 | smd 3.81 x 2.007: 4 0,3.15
53047-08 = drill 0.5 pad 0.698 long: 1 4.375,0; 2 3.125,0; 3 1.875,0; 4 0.625,0; 5 -0.625,0; 6 -1.875,0; 7 -3.125,0; 8 -4.375,0
B3S = smd 1.55 x 1.3: P$1 4,-2.25; P$2 -4,-2.25; P$3 4,2.25; P$4 -4,2.25
SC59-BEC = smd 1 x 1.4: B -0.95,-1.2; C 0,1.2; E 0.95,-1.2
53047-04 = drill 0.5 pad 0.698 long: 1 1.875,0; 2 0.625,0; 3 -0.625,0; 4 -1.875,0

### Placement (x,y rotation side)
ANALOG  21.46,33.36 0 bottom
ANTENNA  48.84,19.77 90 top
C1  21.46,10 270 bottom
C1_1  4.95,21.17 270 bottom
C2  25.52,10.25 90 bottom
C3  8.63,30.44 90 top
C3_1  20.34,15.72 90 top
C4  8.12,28.03 0 bottom
C4_1  4.95,18.89 90 top
C5  21.46,19.27 90 bottom
C5_1  12.57,11.34 0 top
C6  8.12,25.36 0 bottom
C6_1  13.45,26.13 180 top
C7  12.82,31.08 90 top
C7_1  19.81,22.82 90 top
C8  17.77,20.28 90 bottom
C8_1  24.38,19.9 90 top
C9  17.39,8.85 90 bottom
C9_1  24.38,22.19 270 top
C10  26.92,16.98 270 bottom
C18  25.01,12.03 270 top
C20  27.55,12.15 270 top
C21  29.97,12.41 270 top
C77  35.3,28.66 270 bottom
C101  14.73,8.6 180 top
C102  11.3,5.42 180 top
C103  14.22,6.95 90 top
C104  5.84,10 90 top
C105  4.19,10.76 90 top
C106  6.6,5.42 180 top
CAMERA  5.46,2.76 270 bottom
CON_ESC  13.33,28.16 90 bottom
D1  26.41,27.27 0 bottom
D2  7.36,21.55 270 bottom
GPS  37.59,12.54 0 bottom
IC1  20.19,7.2 270 top
IC2  9.07,7.37 90 top
L1  10.15,12.15 270 bottom
L2  26.66,9.74 90 bottom
LED1  28.82,20.41 90 top
LED2  28.82,23.2 90 top
MCU  12.45,18.71 180 top
Q1  22.27,21.47 90 top
R1  4.06,25.36 180 bottom
R2  28.82,19.01 0 top
R3  28.82,21.81 0 top
R4  3.8,21.17 90 bottom
R5  17.9,14.57 270 bottom
R6  17.9,17.61 270 bottom
R7  16.63,29.3 0 top
R8  28.7,24.98 0 top
R9  9.65,30.7 270 top
R10  11.68,30.7 270 top
R11  6.73,30.95 0 top
R12  28.82,27.01 90 bottom
R13  3.93,15.84 90 top
R14  4.82,21.43 270 top
R15  16.63,27.27 90 top
R16  4.57,18.63 0 bottom
R17  13.46,29.55 270 bottom
R18  14.47,25.62 180 bottom
R101  15.24,6.69 90 top
R102  13.2,6.69 270 top
R103  7.74,9.49 0 top
R104  4.44,6.95 270 top
R105  2.41,6.44 180 top
RC_RX  2.15,9.61 270 bottom
REG1  12.82,21.3 90 bottom
REG2  27.3,5.17 180 top
S0  12.57,2.76 270 bottom
S1  9.27,2.76 270 bottom
S3  22.47,2.76 270 bottom
S4  15.87,2.76 270 bottom
S5  19.17,2.76 270 bottom
SERIAL_1  2.15,18.38 270 bottom
SERIAL_2  7.11,33.36 0 bottom
SW1  25.9,28.92 180 top
T1  4.06,29.81 0 top
VIDEO_TX  2.15,3.39 270 bottom

### Tracks (layer width: path | path; a pad name or v marks a point on that pad's centre or on a via)
+3V3  (via drill 0.35)
  Top 0.203: v5.08,5.42 5.96,5.42 | 5.96,5.42 C106.2 | IC2.8 6.15,5.42 5.96,5.42 | 12.82,25.87 12.85,25.9 C6_1.2 | MCU.23 5,19.46 4.95,19.52 | 4.95,19.52 C4_1.2 | v3.8,22.7 4.06,22.44 4.44,22.44 4.82,22.06 R14.1 | 4.95,19.52 4.19,19.52 v4.06,19.65 | MCU.49 17.12,14.96 16.89,15.2 16.89,15.71 17.14,15.96 MCU.51 19.43,15.96 20.32,15.96 20.32,16.29 C3_1.2 | 12.82,26.12 C6_1.2 | v12.57,27.01 12.82,26.76 12.82,26.12 | 12.82,26.12 12.83,26.13 C6_1.2 | MCU.7 13.2,25.74 12.82,26.12 | C3_1.2 20.57,16.32 | MCU.43 13.7,11.89 13.17,11.36 C5_1.2 13.17,11.29 13.2,11.27 v14.09,11.27 | v27.17,21.81 R3.1 28.19,21.81 28.82,21.17 28.82,19.65 28.19,19.01 R2.1 | C3_1.2 20.32,16.35 20.06,16.35 20.06,17.87 v20.32,18.12 | v25.52,22.95 25.52,23.08 25.01,23.58 24.63,23.58 24,24.22 20.57,24.22 20.44,24.09 20.44,22.57 20.19,22.31 19.81,22.31 C7_1.1 19.81,22.19 19.58,21.96 MCU.63 | IC1.16 21.98,9.48 v21.71,9.74 | 28.06,24.98 R8.1 v27.17,24.98 | T1.E 4.95,28.55 v4.95,27.39 | R13.1 3.93,15.2 2.2,15.2 SERIAL_1.2
  Bottom 0.203: L2.2 26.66,11.9 v26.41,12.15 | v3.8,22.7 R4.2 | R16.1 5.22,19.12 4.69,19.65 v4.06,19.65 | D1.1 27.34,26.17 27.17,26 v27.17,24.98
  other vias: 27.17,12.15
  pour Route15 (isolate 0.203): 0.38,0.34 33.78,0.34 33.78,35.14 0.38,35.14
  pour Top (isolate 0.203, no thermals): 26.16,12.28 26.16,9.61 26.54,9.23 26.54,7.46 28.06,7.46 28.06,9.23 29.84,11.01 30.48,11.01 30.48,12.28
+5V  (via drill 0.35)
  Bottom 0.203: R5.2 17.25,13.92 15.62,12.28 15.62,9.36 15.87,9.11 16.51,9.11 17.27,8.34
  Bottom 0.406: 2.15,2.76 2.79,2.76 3.68,3.64 3.68,8.73 2.79,9.61 RC_RX.2
  Bottom 0.813: 24.12,2.76 S5.2 S4.2 S0.2 S1.2 CAMERA.2 2.15,2.76 | 24.12,2.76 S3.2 | 24.12,2.76 24.12,6.31
  Bottom 1.016: VIDEO_TX.2 2.15,2.76
  other vias: 25.52,6.57 24.63,6.57 26.41,6.57
  pour Bottom (no thermals): 7.49,8.47 18.28,8.47 18.28,7.96 24,7.96 24,6.95 26.66,6.95 26.66,6.19 24,6.19 24,5.68 7.49,5.68
  pour Top (no thermals): 24.38,6.19 24.38,11.52 25.65,11.52 25.65,6.95 26.66,6.95 26.66,6.19
ADC_0  (via drill 0.35)
  Top 0.203: MCU.15 9.2,26.7 10.92,28.41 12.06,28.41 13.97,30.32 v13.97,31.2
  Bottom 0.203: v13.97,31.2 14.85,32.09 17.39,32.09 18.33,33.03 ANALOG.3
ADC_1  (via drill 0.35)
  Top 0.203: MCU.14 9.7,26.69 11.04,28.03 12.31,28.03 14.6,30.32 v14.6,30.57
  Bottom 0.203: v14.6,30.57 14.6,30.95 15.36,31.71 18.41,31.71 19.58,32.89 ANALOG.4
ADC_2
  Top 0.203: MCU.13 10.2,26.68 11.17,27.65 12.57,27.65 17.01,32.09 20.19,32.09 20.83,32.74 ANALOG.5
ADC_3
  Top 0.203: MCU.2 15.7,25.27 15.24,25.74 15.24,29.81 17.14,31.71 20.57,31.71 20.95,32.09 21.46,32.09 22.08,32.72 ANALOG.6
ADC_4  (via drill 0.35)
  Top 0.203: v21.97,18.63 21.97,15.46 20.82,14.31 17.14,14.31 15.74,15.71 12.44,15.71 11.2,14.47 MCU.38
  Bottom 0.203: v21.97,18.63 23.24,19.9 23.24,30.95 23.33,31.05 ANALOG.7
ADC_5  (via drill 0.35)
  Top 0.203: v22.6,17.87 22.35,17.61 22.35,15.33 20.95,13.93 16.89,13.93 15.49,15.33 12.7,15.33 11.7,14.34 MCU.39
  Bottom 0.203: v22.6,17.87 23.62,18.89 23.62,30.7 24.51,31.59 24.58,31.66 ANALOG.8
ADC_6  (via drill 0.35)
  Top 0.203: 23.24,17.11 v23.36,17.23 22.73,16.6 22.73,15.2 21.08,13.55 19.17,13.55 17.52,11.9 14.98,11.9 14.7,12.18 MCU.45
  Bottom 0.203: v23.36,17.23 24,17.87 24,30.44 25.83,32.28 ANALOG.9
ADC_7  (via drill 0.35)
  Top 0.203: v23.36,16.22 23.11,15.96 23.11,15.07 21.2,13.17 19.55,13.17 17.77,11.39 15.11,11.39 14.35,10.63 10.79,10.63 9.7,11.72 MCU.35
  Bottom 0.203: v23.36,16.22 24.38,17.23 24.38,30.19 27.08,32.89 ANALOG.10
AUDIO
  Top 0.203: R105.1 3.04,6.44 | VIDEO_TX.4 2.15,5.3 3.04,6.19 | R105.1 3.06,6.2 3.04,6.19 | 3.04,6.19 3.04,6.42 R105.1 | R104.2 4.44,6.31 4.31,6.44 R105.1
BUTTON  (via drill 0.35)
  Top 0.203: MCU.46 15.2,13.96 14.98,14.19 14.6,14.19 v14.09,14.69 | v12.95,21.3 15.11,21.3 18.41,24.6 24.12,24.6 24.76,23.96 25.27,23.96 | 25.27,23.96 25.65,24.35 25.65,24.98 24,26.63 21.94,26.63 SW1.P$3 21.88,26.67 21.84,26.63 | SW1.P$4 29.88,26.67 29.88,25.53 29.33,24.98 R8.2 29.59,24.98 v30.22,24.35 | 25.27,23.96 v25.52,23.96
  Bottom 0.203: v14.09,14.69 13.2,15.58 13.2,21.04 v12.95,21.3 | v25.52,23.96 29.84,23.96 v30.22,24.35
GND  (via drill 0.35)
  Top 0.203: C104.2 v5.84,11.52 | C103.2 14.22,8.34 13.97,8.6 | 13.97,8.6 C101.2 | 13.97,8.6 13.2,8.6 | 13.2,8.6 12.25,8.6 IC2.4 11.56,8.34 11.55,8.34 | 14.09,26.12 14.22,26.12 | MCU.25 5.16,18.46 4.95,18.25 | 4.95,18.25 C4_1.1 | 4.95,18.25 4.57,18.25 v3.93,17.61 | C106.1 7.23,5.42 v7.23,4.53 | MCU.6 13.7,25.86 13.97,26.13 C6_1.1 14.09,26.12 | v14.22,27.27 14.09,27.14 14.09,26.12 | 13.2,8.6 v13.2,8.85 | MCU.59 19.24,19.96 19.55,19.65 v19.55,18.89 | MCU.50 20.32,15.46 20.32,15.12 C3_1.1 20.74,15.12 21.33,15.71 v21.33,17.87 | MCU.42 13.2,12.28 12.95,12.03 12.57,12.03 11.93,11.39 | 11.93,11.39 11.97,11.35 C5_1.1 | 11.93,11.39 v11.04,11.39 | IC1.8 17.79,4.93 18.03,5.17 18.28,5.17 18.54,5.42 v18.66,5.42 | v8.25,20.92 8.25,21.55 7.84,21.96 MCU.18 | SW1.P$1 22.35,30.72 v22.35,29.93 | SW1.P$2 29.61,31.46 v28.06,31.46 | C9_1.2 24.38,21.04 | 24.38,21.04 C8_1.2 | 24.38,21.04 v25.27,21.04 | C7_1.2 18.12,23.42 v18.03,23.33 | R15.1 16.63,26 v16.89,25.74 | C7.2 13.55,31.68 v13.97,32.09 | C3.2 8.98,30.7 10.28,30.7 10.66,31.08 v10.66,31.84 | RC_RX.1 2.15,8.34 1.76,7.95 R105.2
  Route2 0.203: 35.43,19.9 35.43,17.61 v35.94,17.11 | 33.4,19.9 33.27,20.03 33.27,21.81
  Route2 1.016: 35.43,19.9 33.4,19.9
  Bottom 0.203: v2.15,25.36 R1.1 | C2.2 25.52,14.19 v26.54,15.2 26.54,15.96 26.92,16.35 C10.2 | GPS.7 27.95,10.48 27.81,10.63 27.81,14.69 v27.3,15.2 | C1_1.1 4.95,22.95 v5.46,23.46 | C9.2 17.23,9.87 v16.25,9.87 | R6.1 18.93,18.27 v19.55,18.89 | 29.59,20.92 GPS.14 | 29.59,20.92 GPS.13 29.59,20.92 | 29.59,20.92 | 29.59,20.92 30.6,20.92 30.6,21.55 v30.35,21.81 | R18.2 16.76,25.62 v16.89,25.74
  Bottom 0.305: 47.86,17.67 arc-36 46.97,18.92
  Bottom 0.406: 47.44,21.57 arc21 46.95,20.71
  Bottom 0.813: D2.P$1 7.36,23.2 8.63,21.93 REG1.3
  other vias: 29.97,14.31 17.39,24.6 6.98,29.55 6.22,29.55 20.44,11.39 21.59,11.39 22.6,11.39 26.28,5.42 26.28,4.41 27.05,4.92 47.49,21.93 48.89,22.7 50.67,22.57 51.94,21.55 52.57,19.9 47.87,17.36 49.4,16.85 50.92,17.11 52.06,18.25 37.33,32.86 39.37,32.86 41.4,32.86 43.43,32.86 45.46,32.86 47.49,32.86 49.53,32.86 51.56,32.86 53.59,32.86 55.62,32.86 57.65,32.86 59.69,32.86 61.72,32.86 61.72,30.57 61.72,28.54 61.72,26.5 61.72,24.47 61.72,22.44 61.72,20.41 61.72,18.38 61.72,16.35 61.72,14.31 61.72,12.28 61.72,10.25 61.72,8.22 61.72,6.82 59.69,6.82 57.65,6.82 55.62,6.82 53.59,6.82 51.56,6.82 49.53,6.82 47.75,6.82 43.43,6.82 41.4,6.82 39.37,6.82 37.33,6.82 35.94,6.82 35.94,8.98 35.94,11.01 35.94,13.04 35.94,15.07 35.94,19.14 35.94,21.17 35.94,23.2 35.94,25.24 35.94,27.27 35.94,29.3 35.94,31.33 35.94,32.86 54.48,9.61 48.51,9.49 48.51,11.9 46.35,13.55 43.3,13.3 42.54,10.88 39.87,8.73 38.48,10.63 40.51,12.41 42.41,16.09 42.54,18.63 42.54,21.04 44.32,22.82 46.48,23.58 51.05,9.61 51.68,12.28 57.53,11.27 59.05,13.3 56.13,13.68 50.41,14.57 53.97,15.33 56,17.23 58.67,16.09 59.43,19.27 56.51,20.41 54.61,18.89 54.86,22.7 58.16,23.46 59.05,26.76 58.42,29.81 55.88,26.25 53.21,25.11 49.91,25.24 52.57,27.9 55.49,28.92 50.41,30.57 48.38,27.9 46.73,30.57 39.49,16.6 38.98,19.65 41.14,23.58 38.98,22.06 59.56,9.61 53.97,30.82 38.09,24.09 40.89,26.38 44.06,25.74 47.37,26 44.83,28.16 40.38,29.04 42.79,30.32 54.48,12.15 38.73,14.31
  pour Route2 (isolate 0.203): 0.63,34.84 33.78,34.84 33.78,0.65 0.66,0.65
  pour Bottom (no thermals): 20.06,14.82 20.06,18.12 22.73,18.12 22.73,14.82
  pour Bottom (no thermals): 20.06,14.31 22.86,14.31 22.86,11.14 20.06,11.14
  pour Top (no thermals): 24.38,12.54 24.38,15.2 25.65,15.2 25.65,12.54
  pour Top (no thermals): 24.38,12.54 24.38,15.46 28.82,15.46 28.82,12.79 26.03,12.79 25.78,12.54
  pour Top (no thermals): 29.59,12.79 29.59,14.57 30.35,14.57 30.35,12.79
  pour Bottom (no thermals): 5.84,27.01 5.84,29.81 7.36,29.81 7.36,27.01
  pour Bottom (no thermals): 15.62,26.63 20.57,26.63 20.57,24.85 18.28,24.85 18.28,20.79 17.77,20.28 14.35,20.28 14.35,21.04 16.63,21.04 17.01,21.43 17.01,24.6 16.76,24.85 15.62,24.85
  pour Bottom (no thermals): 5.08,24.09 8.12,24.09 8.12,21.93 5.08,21.93
  pour Top (no thermals): 28.82,9.23 30.22,9.23 30.22,7.33 30.22,6.95 27.43,4.15 26.03,4.15 26.03,5.68 27.3,5.68 28.82,7.2
  pour Bottom (isolate 0.203): 35.17,33.49 62.48,33.49 62.48,6.06 35.17,6.06
  pour Route15 (isolate 0.203, no thermals): 35.17,33.49 49.53,33.49 49.53,22.44 arc180 49.53,17.11 49.53,6.06 35.17,6.06
  pour Route15: 49.53,33.49 62.48,33.49 62.48,6.06 49.53,6.06 49.53,17.11 arc180 49.53,22.44
  pour Route2 (isolate 0.203): 35.17,33.49 49.53,33.49 49.53,22.44 arc180 49.53,17.11 49.53,6.06 35.17,6.06
  pour Route2 (isolate 0.203): 49.53,33.49 62.48,33.49 62.48,6.06 49.53,6.06 49.53,17.11 arc180 49.53,22.44
  pour Top (isolate 0.203): 35.17,33.49 49.53,33.49 49.53,22.44 arc180 49.53,17.11 49.53,6.06 35.17,6.06
  pour Top (isolate 0.203): 49.53,33.49 62.48,33.49 62.48,6.06 49.53,6.06 49.53,17.11 arc180 49.53,22.44
LED_1  (via drill 0.35)
  Top 0.203: MCU.60 20.24,20.46 20.32,20.54 22.22,20.54 22.47,20.28 22.47,19.01 22.98,18.5 24.89,18.5 25.52,19.14 v25.52,19.27 | LED1.C 27.81,20.41 27.81,19.9 v27.17,19.27
  Bottom 0.203: v25.52,19.27 v27.17,19.27
LED_2  (via drill 0.35)
  Top 0.203: MCU.4 14.7,25.47 14.85,25.62 14.85,27.65 14.47,28.03 v14.47,28.54 | v22.35,28.92 22.73,28.92 26.54,25.11 26.54,23.96 27.3,23.2 LED2.C 27.81,23.2
  Bottom 0.203: v22.35,28.92 21.97,29.3 20.95,29.3 20.82,29.43 15.36,29.43 v14.47,28.54
LPC_AUDIO  (via drill 0.35)
  Top 0.203: R101.2 15.24,8.6 C101.1 16.12,8.6 v16.25,8.47 | v13.33,22.95 12.7,22.95 12.2,23.44 MCU.9
  Bottom 0.203: v16.25,8.47 16,8.73 15.62,8.73 15.24,9.11 15.24,12.54 16.76,14.06 16.76,17.87 16.38,18.25 13.97,18.25 13.58,18.63 13.58,22.7 v13.33,22.95
LPC_CLOCK
  Top 0.203: MCU.61 22.43,20.96 23.36,20.03 23.36,19.63 Q1.P$1 23.73,19.27 24.38,19.27 C8_1.1
LPC_INT
  Top 0.203: SERIAL_2.7 8.98,32.83 8.25,32.09 7.11,32.09 6.73,31.71 6.73,30.32 6.85,30.19 7.23,30.19 7.62,29.81 7.62,27.65 7.36,27.39 7.36,26.76 7.74,26.38 7.74,23.08 8.88,21.93 8.88,16.22 8.13,15.46 MCU.31
LPC_MISO  (via drill 0.35)
  Top 0.203: MCU.53 17.12,16.96 16.38,16.22 14.85,16.22 13.97,17.11 13.71,17.11 10.92,19.9 10.92,21.17 8.7,23.38 MCU.16 8.7,27.7 v8.38,28.03
  Bottom 0.203: v8.38,28.03 8.38,30.06 7.62,30.82 6.85,30.82 5.23,32.44 SERIAL_2.4
LPC_MOSI  (via drill 0.35)
  Top 0.203: MCU.54 16.99,17.46 16.12,16.6 15.11,16.6 14.09,17.61 13.84,17.61 11.3,20.15 11.3,22.19 v11.68,22.57
  Bottom 0.203: v11.68,22.57 11.93,22.82 11.93,29.81 11.04,30.7 10.66,30.7 8.38,30.7 7.74,31.33 6.98,31.33 6.48,31.83 SERIAL_2.5
LPC_P0.14  (via drill 0.35)
  Top 0.203: MCU.41 v12.7,14.43 v12.7,14.44
  Bottom 0.203: v12.7,14.44 12.19,14.95 7.11,14.95 5.58,16.47 5.58,17.49 5.33,17.74 4.69,17.74 4.06,18.38 4.06,18.49 R16.2 | SERIAL_1.5 2.67,19 3.04,18.63 R16.2 | R16.2 3.93,18.63
LPC_P0.23  (via drill 0.35)
  Top 0.203: v12.95,22.19 12.7,22.19 12.31,21.81 12.31,21.04 13.89,19.46 MCU.58
  Bottom 0.203: 13.58,25.62 13.58,24.35 12.7,23.46 12.7,22.44 v12.95,22.19 | 13.58,25.62 13.58,28.16 13.46,28.28 R17.2 | 13.58,25.62 R18.1
LPC_RESET  (via drill 0.35)
  Top 0.203: MCU.57 16.97,18.96 v15.62,17.61
  Bottom 0.203: SERIAL_1.6 3.8,20.25 | 3.8,20.25 R4.1 | v15.62,17.61 15.87,17.36 15.87,14.31 15.62,14.06 13.84,14.06 13.33,14.57 13.33,14.82 12.82,15.33 7.23,15.33 5.96,16.6 5.96,19.77 5.49,20.25 4.95,20.25 | 3.8,20.25 4.95,20.25 | 4.95,20.25 C1_1.2
LPC_RXD_0
  Top 0.203: MCU.21 6.04,20.46 5.58,20.92 5.58,21.17 5.33,21.43 2.23,21.43 SERIAL_1.7
LPC_RXD_1  (via drill 0.35)
  Top 0.203: v23.49,10.12 22.86,10.76 17.01,10.76 16.89,10.88 15.24,10.88 14.6,10.25 10.66,10.25 9.2,11.71 MCU.34
  Bottom 0.203: GPS.3 28.16,6.09 26.92,7.33 25.9,7.33 24.12,9.11 24.12,9.49 v23.49,10.12
LPC_SCK  (via drill 0.35)
  Top 0.203: MCU.47 15.7,14.23 v15.24,14.69 | v8,27.14 8.25,26.89 8.25,23.2 10.54,20.92 10.54,19.65 v13.84,16.35
  Bottom 0.203: v8,27.14 7.74,27.39 7.74,29.93 7.36,30.32 6.6,30.32 3.98,32.93 SERIAL_2.3 | v13.84,16.35 15.24,14.95 v15.24,14.69
LPC_SCL0
  Top 0.203: R14.2 4.93,20.78 4.95,20.79 5.77,19.96 MCU.22 | SERIAL_1.4 3.18,17.75 3.42,18 3.42,20.03 4.17,20.78 R14.2 | R14.2 4.82,20.79
LPC_SDA0
  Top 0.203: MCU.26 5.93,17.96 4.46,16.49 R13.2 3.93,16.47 arc90 3.9,16.5 SERIAL_1.3
LPC_SSEL  (via drill 0.35)
  Top 0.203: MCU.55 16.85,17.96 15.87,16.98 15.36,16.98 12.06,20.28 v12.06,20.41
  Bottom 0.203: v12.06,20.41 12.06,22.06 12.31,22.31 12.31,23.71 13.2,24.6 13.2,27.39 12.44,28.16 12.44,30.06 11.3,31.2 9.27,31.2 7.73,32.74 SERIAL_2.6
LPC_TXD_0
  Top 0.203: MCU.19 5.92,21.46 5.71,21.68 5.71,22.44 5.33,22.82 4.82,22.82 4.31,23.33 2.73,23.33 SERIAL_1.8
LPC_TXD_1  (via drill 0.35)
  Top 0.203: MCU.33 8.7,11.7 10.54,9.87 14.85,9.87 15.49,10.5 16.76,10.5 16.89,10.38 22.35,10.38 22.47,10.25 v22.47,10.12
  Bottom 0.203: GPS.4 29.59,7.2 27.81,7.2 27.17,7.84 25.9,7.84 24.51,9.23 24.51,10 23.74,10.76 23.11,10.76 v22.47,10.12
LPC_USB_CONNECT
  Top 0.203: MCU.17 6.85,22.44 | MCU.17 | MCU.17 6.85,23.33 3.17,27.01 3.17,28.55 T1.B
LPC_USB_N  (via drill 0.35)
  Top 0.203: MCU.11 11.2,25.78 v11.3,25.87 | v10.66,30.06 11.66,30.06 R10.2 12.43,30.05 12.82,30.44 C7.1
  Bottom 0.203: v11.3,25.87 10.66,26.5 10.66,29.93 v10.66,30.06
LPC_USB_P  (via drill 0.35)
  Top 0.203: MCU.10 11.7,25.39 11.93,25.62 11.93,26.25 v11.3,26.89 | v11.3,29.04 10.65,29.04 R9.2 9.65,30.06 | 9.65,30.06 9.61,30.1 | R11.2 8.52,29.81 8.63,29.81 C3.1 8.85,30.06 9.65,30.06
  Bottom 0.203: v11.3,26.89 v11.3,29.04
N$1
  Bottom 0.203: GPS.6 29.59,8.34 | GPS.5 29.59,8.34 | 26.66,8.73 26.66,8.6 25.61,9.65 C2.1 | 29.59,8.34 27.94,8.34 27.55,8.73 26.66,8.73 | 26.66,8.73 L2.1
N$2
  Bottom 0.406: 49.6,18.81 49.6,18.83
N$3
  Bottom 0.813: ANTENNA.P$1 49.53,19.77 49.51,19.79 GPS.16
N$4
  Bottom 0.203: R17.1 13.46,30.7 12.73,31.42 SERIAL_2.10
N$5
  Top 0.203: MCU.62 20.35,21.46 21.2,22.31 21.2,23.46 | 21.2,23.46 21.18,23.46 | C9_1.1 24.38,22.95 | 21.2,23.46 21.2,23.35 Q1.P$3 | 21.2,23.46 22.22,22.44 24.38,22.44 C9_1.1 | C9_1.1 24.38,22.7
N$6
  Bottom 0.61: 9.65,25.39 9.65,25.49 | REG1.4 9.65,23.78 9.65,25.39 | 9.65,28.05 9.65,28.16 | 9.65,28.05 C4.1 | C6.1 9.65,25.39 | 9.65,25.39 9.65,28.05
N$7
  Top 0.203: 6.09,30.95 R11.1 4.12,30.95 T1.C
N$8
  Bottom 0.406: R1.2 C6.2
N$9
  pour Bottom (no thermals): 6.47,20.28 8.12,20.28 8.63,19.77 12.82,19.77 12.82,15.71 7.49,15.71 6.47,16.73
N$10
  Bottom 0.203: REG1.5 14.35,23.2 13.97,22.82 13.97,18.89 14.22,18.63 17.01,18.63 17.14,18.5 17.14,16.35 17.39,16.09 17.9,16.09 | R6.2 17.9,16.09 | R5.1 17.9,16.09
  Bottom 0.406: REG1.5 15.49,23.2
N$14
  Top 0.203: C105.+ 4.19,11.77 5.2,10.76 5.2,7.96 5.47,7.69 IC2.6 6.15,7.13 6.09,7.07 6.13,7.04 IC2.7
N$15
  Top 0.203: 11.12,6.39 IC2.1 12,7.01 11.97,7.04 | C102.2 10.7,5.97 11.12,6.39 | 11.97,7.04 11.93,7.07 | 11.97,7.04 IC2.2 | 11.12,6.39 11.09,6.39 8.39,9.09 R103.2
N$16
  Top 0.203: C102.1 12.41,5.93 13.2,5.93 R102.2 13.7,5.55 14.73,5.55 15.24,6.06 R101.1
N$17
  Top 0.203: IC2.3 12.84,7.69 13.2,7.33 | C103.1 14.22,6.31 13.2,7.33 | 13.2,7.33 R102.1
N$18
  Top 0.203: C105.- 4.19,9.36 4.44,9.11 R104.1
N$19
  Top 0.203: IC2.5 6.15,9.49 5.84,9.49 | 5.84,9.49 C104.1 | 5.84,9.49 R103.1
N$21
  Top 0.203: R2.2 29.46,19.01 29.87,19.43 LED1.A
N$22
  Top 0.203: R3.2 29.46,21.81 29.87,22.22 LED2.A
N$28
  Bottom 0.203: R12.1 29.6,26.36 30.09,25.87 31.87,25.87 31.87,26 | 31.87,26 C77.PLUS | C10.1 26.92,17.61 26.95,17.59 GPS.11 31.46,17.59 31.87,18 31.87,26
N$29
  Bottom 0.203: R12.2 28.82,27.65 28.11,28.37 D1.3
PPM_IN  (via drill 0.35)
  Top 0.203: MCU.30 5.84,15.96 5.46,15.58 v5.46,14.95
  Bottom 0.203: RC_RX.3 2.15,12.28 3.68,13.8 4.44,13.8 5.46,14.82 v5.46,14.95
SERV_0
  Top 0.203: S0.3 12.8,4.01 13.58,4.79 16,4.79 16.38,5.17 16.38,6.57 16.69,6.88 IC1.5
SERV_1
  Top 0.203: S1.3 10.05,4.79 12.7,4.79 13.08,5.17 15.74,5.17 16,5.42 16,7.07 16.45,7.53 IC1.4
SERV_2  (via drill 0.35)
  Top 0.203: v21.2,29.93 21.2,28.54 21.97,27.78 23.36,27.78 26.16,24.98 26.16,18.12 23.49,15.46 23.49,14.95 21.33,12.79 20.06,12.79 v18.66,11.39 | v20.44,9.36 20.32,9.49 18.54,9.49 18.16,9.11 18.16,8.6 17.73,8.18 IC1.3
  Bottom 0.203: v18.66,11.39 18.92,11.14 18.92,10.88 v20.44,9.36 | v21.2,29.93 20.57,30.57
  pour Bottom (no thermals): 20.57,29.93 15.62,29.93 15.62,31.33 20.57,31.33
SERV_3
  Top 0.203: IC1.10 23.77,5.58 23.87,5.68 | 23.87,5.68 23.87,8.73 23.77,8.83 IC1.15 | S3.3 23.47,4.01 23.87,4.41 23.87,5.68
SERV_4
  Top 0.203: IC1.13 22.42,7.53 21.71,6.82 21.71,6.31 20.19,4.79 18.28,4.79 17.5,4.01 S4.3
SERV_5
  Top 0.203: IC1.12 22.4,6.88 22.22,6.69 22.22,6.06 20.17,4.01 S5.3
SERV_CLK  (via drill 0.35)
  Top 0.203: MCU.29 6.73,16.46 6.73,16.47 5.33,16.47 4.82,15.96 4.82,14.69 5.33,14.19 5.71,14.19 10.42,9.48 15.63,9.48 15.87,9.23 16.51,9.23 16.75,9.48 IC1.1 17.89,9.48 18.41,10 20.7,10 21.08,9.61 21.08,7.07 19.55,5.55 v19.55,5.42 | IC1.9 23.11,4.92 22.22,4.92 v22.09,5.04
  Bottom 0.203: v19.55,5.42 19.81,5.17 21.97,5.17 v22.09,5.04
SERV_DATA  (via drill 0.35)
  Top 0.203: MCU.48 16.27,13.04 v17.52,13.04 | IC1.7 17.93,5.58 19.05,6.69 19.05,8.34 v19.17,8.47
  Bottom 0.203: v17.52,13.04 18.03,12.54 18.03,10.88 18.28,10.63 18.28,9.74 19.17,8.85 v19.17,8.47
SERV_RESET  (via drill 0.35)
  Top 0.203: MCU.56 18.96,18.46 19.43,18 v19.43,17.61 | IC1.6 17.94,6.23 18.54,6.82 18.54,8.85 18.79,9.11 19.55,9.11 v20.06,8.6 | IC1.14 22.26,8.18 v21.71,8.73
  Bottom 0.203: v19.43,17.61 19.3,17.49 19.3,11.27 20.7,9.87 20.82,9.87 21.08,9.61 21.08,8.73 | 21.08,8.73 v21.71,8.73 | 21.08,8.73 20.19,8.73 v20.06,8.6
USB+
  Top 0.203: SERIAL_2.8 10.23,32.81 9.65,32.22 R9.1 9.65,31.33
USB-
  Top 0.203: R10.1 11.68,31.33 11.48,31.53 SERIAL_2.9
VBAT
  Top 0.203: R7.2 17.85,29.3 CON_ESC.2
  pour Bottom (no thermals): 15.62,28.92 21.08,28.92 22.73,27.27 22.73,21.17 20.57,19.01 14.35,19.01 14.35,19.77 18.03,19.77 18.92,20.66 18.92,24.35 20.95,24.35 20.95,26.89 20.7,27.14 15.62,27.14
VBAT_MEAS
  Top 0.203: MCU.1 16.2,25.41 15.74,25.87 15.74,27.9 16.12,28.28 | R7.1 15.98,28.43 16.12,28.28 | 16.63,27.9 R15.2 16.63,28.28 16.12,28.28
VIDEO
  Top 0.254: CAMERA.3 5.46,4.03 5.45,4.02 VIDEO_TX.3

### Text on the board
tDocu: SERIAL 2 | ANALOG | L2 | L1 | SERIAL 1 | RC | Paparazzi Tiny V0.99 | by Martin & Poine | TX | CAM | S1 | S0 | S4 | S5 | S3